# Altium schematic sheet GSM.SchDoc: GSM
size A4; SheetNumber: 8; SheetTotal: 10
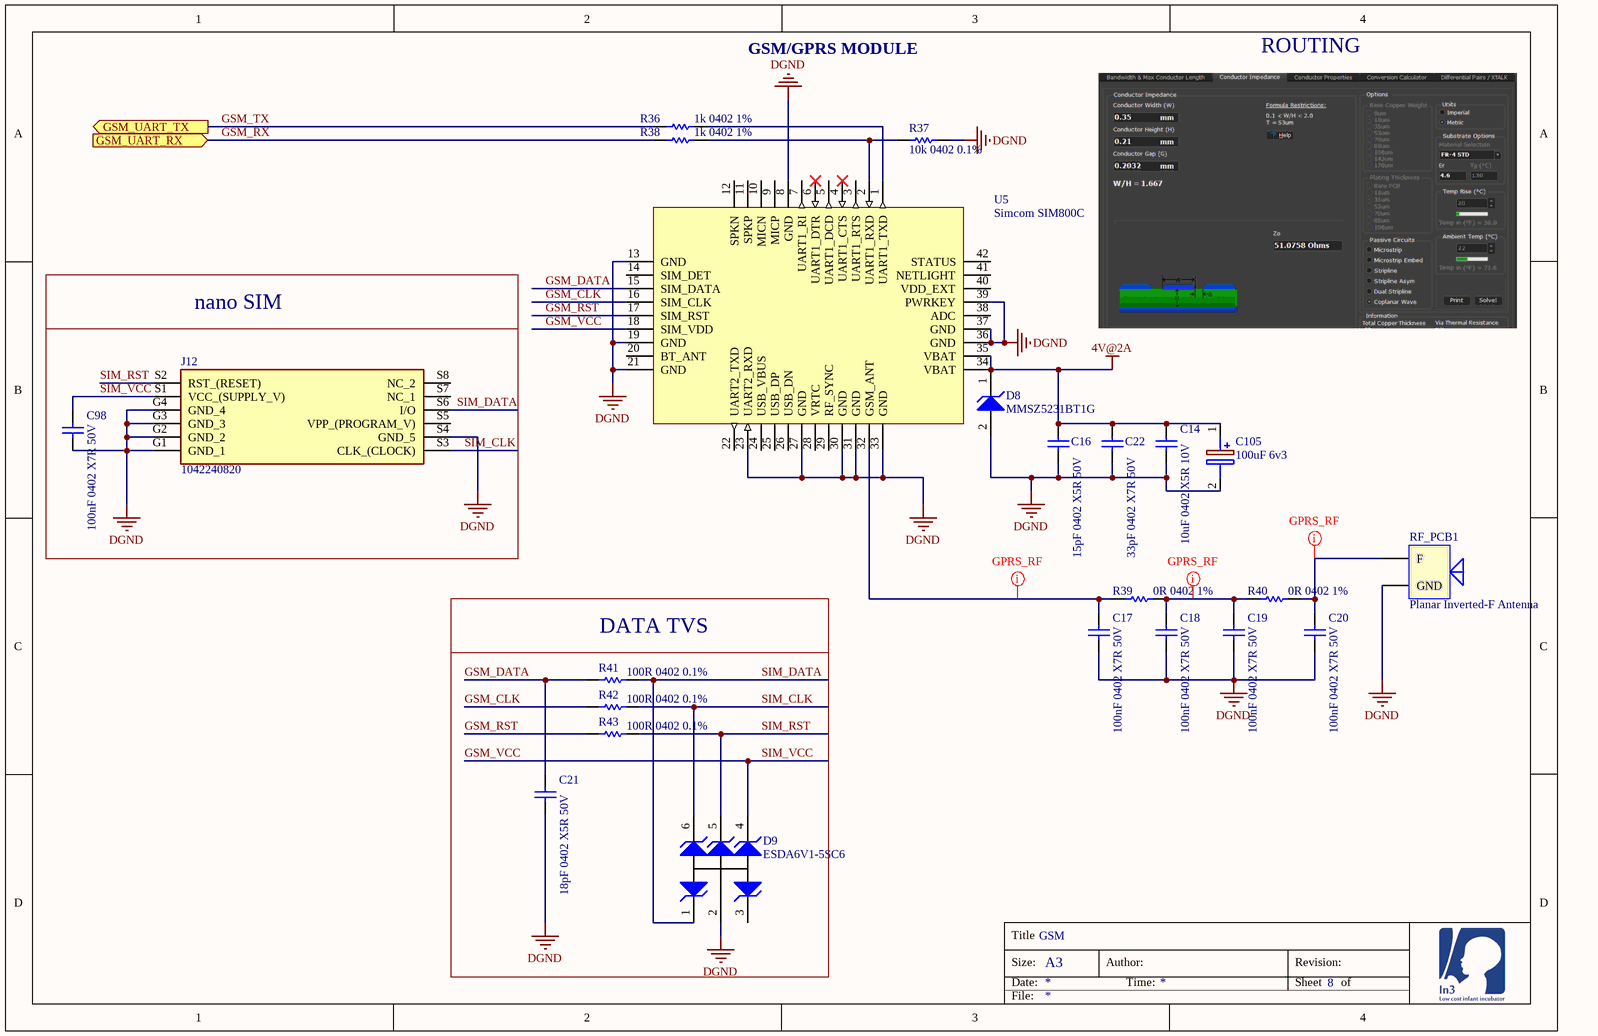
[diagram p0: GSM.SchDoc]

## Parts
C14  10uF 0402 X5R 10V  [CAPC1005X55X25NL5T10]
C16  15pF 0402 X5R 50V  [CAPC1005X55X25NL5T10]
C17  100nF 0402 X7R 50V  [CAPC1005X55X25NL5T10]
C18  100nF 0402 X7R 50V  [CAPC1005X55X25NL5T10]
C19  100nF 0402 X7R 50V  [CAPC1005X55X25NL5T10]
C20  100nF 0402 X7R 50V  [CAPC1005X55X25NL5T10]
C21  18pF 0402 X5R 50V  [CAPC1005X55X25NL5T10]
C22  33pF 0402 X7R 50V  [CAPC1005X55X25NL5T10]
C98  100nF 0402 X7R 50V  [CAPC1005X55X25NL5T10]
C105  100uF 6v3  [CAPPM3216X180N]
D8  MMSZ5231BT1G  [ONSC-SOD-123-2-425-04_V]
D9  ESDA6V1-5SC6  [MF06A_N]
J12  1042240820  [1042240820]
R36  1k 0402 1%  [RESC1005X40X25ML05T10]
R37  10k 0402 0.1%  [RESC1005X40X25ML05T10]
R38  1k 0402 1%  [RESC1005X40X25ML05T10]
R39  0R 0402 1%  [RESC1005X40X25ML05T10]
R40  0R 0402 1%  [RESC1005X40X25ML05T10]
R41  100R 0402 0.1%  [RESC1005X40X25ML05T10]
R42  100R 0402 0.1%  [RESC1005X40X25ML05T10]
R43  100R 0402 0.1%  [RESC1005X40X25ML05T10]
RF_PCB1  Planar Inverted-F Antenna  [PCB-k9titb4465gfk1ijwrnj-1]  (no BOM)
U5  Simcom SIM800C  [SIM800C]

## Blocks framed on the sheet
nano SIM: C98 J12
DATA TVS: C21 D9 R41-R43

## Ports
GSM_UART_RX (in), GSM_UART_TX (out)

## Nets
4V@2A: C14.2 C16.2 C22.1 C105.1(+) D8.1(K) U5.34(VBAT) U5.35(VBAT)
DGND: C14.1 C16.1 C17.1 C18.1 C19.1 C20.1 C21.1 C22.2 C98.1 C105.2(-) D8.2(A) D9.2(K) J12.G1(GND_1) J12.G2(GND_2) J12.G3(GND_3) J12.G4(GND_4) J12.S4(GND_5) R37.1 RF_PCB1.2(GND) U5.8(GND) U5.13(GND) U5.19(GND) U5.21(GND) U5.23(UART2_RXD) U5.27(GND) U5.30(GND) U5.31(GND) U5.33(GND) U5.36(GND) U5.37(GND) U5.39(PWRKEY)
GSM_CLK: R42.2 U5.16(SIM_CLK)
GSM_DATA: C21.2 R41.2 U5.15(SIM_DATA)
GSM_RST: R43.2 U5.17(SIM_RST)
GSM_RX: R38.2 ; port GSM_UART_RX
GSM_TX: R36.2 ; port GSM_UART_TX
GSM_VCC: C98.2 D9.4(A) J12.S1(VCC_(SUPPLY_V)) U5.18(SIM_VDD)  [also labelled SIM_VCC]
SIM_CLK: D9.6(A) J12.S3(CLK_(CLOCK)) R42.1
SIM_DATA: D9.1(K) J12.S6(I/O) R41.1
SIM_RST: D9.5(A) J12.S2(RST_(RESET)) R43.1
NetC17_2: C17.2 R39.2 U5.32(GSM_ANT)
NetC18_2: C18.2 C19.2 R39.1 R40.2
NetC20_2: C20.2 R40.1 RF_PCB1.1(F)
NetR36_1: R36.1 U5.1(UART1_TXD)
NetR37_2: R37.2 R38.1 U5.2(UART1_RXD)

Not connected (* = marked no-connect by the designer): D9 3(K); J12 S5(VPP_(PROGRAM_V)) S7(NC_1) S8(NC_2); U5 3(UART1_RTS) 4(UART1_CTS)* 5(UART1_DCD) 6(UART1_DTR)* 7(UART1_RI) 9(MICP) 10(MICN) 11(SPKP) 12(SPKN) 14(SIM_DET) 20(BT_ANT) 22(UART2_TXD) 24(USB_VBUS) 25(USB_DP) 26(USB_DN) 28(VRTC) 29(RF_SYNC) 38(ADC) 40(VDD_EXT) 41(NETLIGHT) 42(STATUS)

## Layout directives
net class GPRS_RF: NetC17_2, NetC18_2, NetC20_2

## Notes on the sheet
- GSM/GPRS MODULE
- ROUTING
- Title
- Size:
- Date:
- A3
- Author:
- Time:
- Revision:
- Sheet
- of
- File:

## Library data of the parts
C14 C16-C22 C98 = CMP-1662-00020-1: ComponentLink2Description: Datasheet; ComponentLink2URL: http://psearch.en.murata.com/capacitor/product/GRM155R60J105KE19%23.pdf; ComponentLink1Description: Manufacturer URL; ComponentLink1URL: http://www.murata.com/
  C14: LCSC_PN: C77000
  C16: LCSC_PN: C86285
  C17-C20 C98: LCSC_PN: C77020
  C21: LCSC_PN: C33149
  C22: LCSC_PN: C107005
C105 = TMCMA0J107MTRF: Capacitor Polarised; Manufacturer_Name: Vishay; Datasheet Link: http://www.vishay.com/docs/40178/tmcm.pdf; Height: 1.8mm; Manufacturer_Part_Number: TMCMA0J107MTRF; Mouser Part Number: 74-TMCMA0J107MTRF; Mouser Price/Stock: https://www.mouser.co.uk/ProductDetail/Vishay-Sprague/TMCMA0J107MTRF?qs=NgbZBzc1CyGhyyzGhg4Jvg%3D%3D; Arrow Part Number: TMCMA0J107MTRF; Arrow Price/Stock: https://www.arrow.com/en/products/tmcma0j107mtrf/vishay?utm_currency=USD&region=nac; LCSC_PN: C1954161
D8 = CMP-1060-00573-1: Zener Voltage Regulator, 500 mW, 2-Pin SOD-123, Pb-Free, Tape and Reel; Manufacturer: On Semiconductor; P Max (W): 0.5; VZ Typ (V): 5.1; PackageVersion: Rev. G, 10/2009; Mounting Technology: Surface Mount; ComponentLink2Description: Datasheet; ComponentLink3URL: http://www.onsemi.com/pub_link/Collateral/425-04.PDF; PackageDescription: 2-Pin SOD, Body 1.6 x 2.69 mm; Packing: Tape and Reel; ComponentLink2URL: http://www.onsemi.com/pub_link/Collateral/MMSZ5221BT1-D.PDF; ComponentLink1URL: http://www.onsemi.com/; PartNumber: MMSZ5231BT1G; PackageReference: SOD-123-2-425-04; RoHS: Pb-Free; ComponentLink1Description: Manufacturer URL; ComponentLink3Description: Package Specification; DatasheetVersion: Rev. 12; LCSC_PN: C2759896
D9 = CMP-924f5b40f9684d88-1: ESDA Series 5 Channel 6.1 V 50 pF SMT Uni Directional Transil Array - SOT-23-6L; Operating Voltage: 6.10 V; Power Rating: 100 W; Breakdown Voltage: 7.20 V; Lead-Free Status: Lead Free; REACH SVHC Compliance: No SVHC; Number of Pins: 6; Case/Package: SOT-23; Size-Width: 1.75 mm; Mounting Style: Surface Mount; Manufacturer Part Number: ESDA6V1-5SC6; Size-Height: 1.45 mm; OctopartID: 924f5b40f9684d88; Size-Length: 3.05 mm; Packaging: Tape & Reel (TR), Cut Tape (CT); Octopart URL: http://octopart.com/esda6v1-5sc6-stmicroelectronics-347713; RoHS: Compliant; Voltage Rating (DC): 6.10 V; Lifecycle Status: Active; TME: ESDA6V1-5SC6; LCSC Part: C6650; LCSC_PN: C2827672
J12 = 1042240820: Connector; Manufacturer_Name: Molex; Datasheet Link: https://www.molex.com/en-us/products/part-detail-pdf/1042240820?display=pdf; Height: 1.21mm; Manufacturer_Part_Number: 1042240820; Mouser Part Number: N/A; Mouser Price/Stock: https://www.mouser.com/Search/Refine.aspx?Keyword=N%2FA; Arrow Part Number: 1042240820; Arrow Price/Stock: https://www.arrow.com/en/products/1042240820/molex?utm_currency=USD&region=asia; LCSC_PN: C585349
R36-R43 = CMP-2002-07472-1
  R36 R38: LCSC_PN: C106235
  R37: LCSC_PN: C190095
  R39 R40: LCSC_PN: C60485
  R41-R43: LCSC_PN: C106233
RF_PCB1 = CMP-e704afk8c25r4a5ypw1c-12: GSM900 and GSM1800  Frequency Bands PCB antenna; CustomComponentID: e704afk8c25r4a5ypw1c
U5 = CMP-72dbb8ea0133ad1c-5: Module: GSM/Bluetooth; GPRS; 2G; 1800MHz, 900MHz; 85.6kbps; SMD; OctopartID: 72dbb8ea0133ad1c; Manufacturer Part Number: SIM800C; Mounting Style: Surface Mount; Octopart URL: http://octopart.com/sim800c-simcom-54220430; LCSC_PN: C2981431